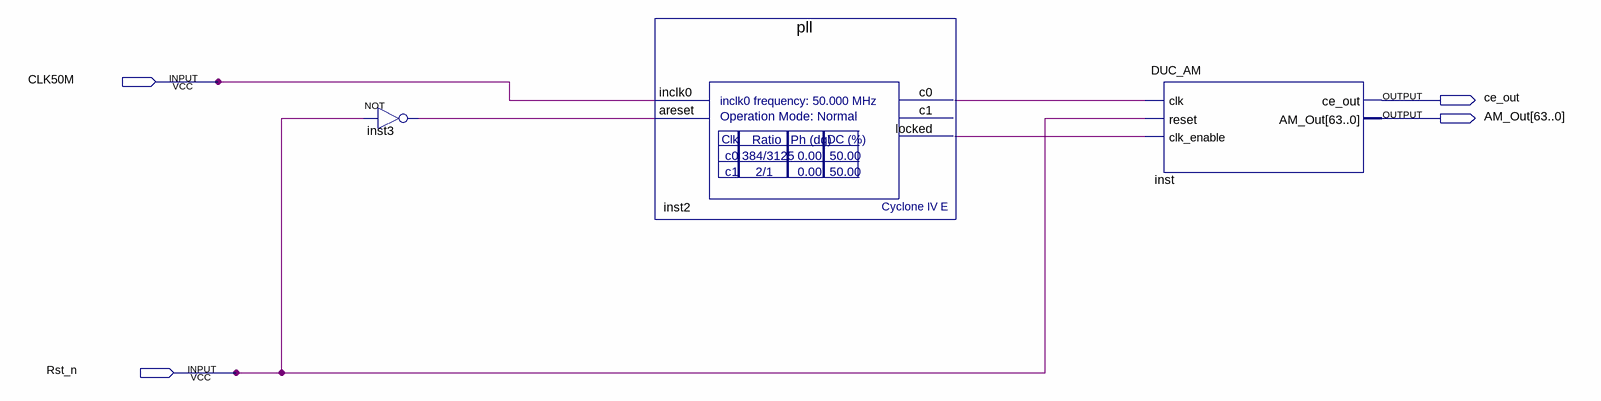
[diagram p0: schematic sheet]
// Quartus schematic DUCAM.bdf as structural Verilog: 3 symbols, 4 pins
module DUCAM (
  input  CLK50M,
  input  Rst_n,
  output ce_out,
  output [63:0] AM_Out
);

  wire inst2_c0, inst2_locked, inst3_out;

  not inst3 (inst3_out, Rst_n);
  pll inst2 (.inclk0(CLK50M), .areset(inst3_out), .c0(inst2_c0), .locked(inst2_locked));  // open: c1
  DUC_AM inst (.clk(inst2_c0), .reset(Rst_n), .clk_enable(inst2_locked), .ce_out(ce_out), .AM_Out(AM_Out));
endmodule
